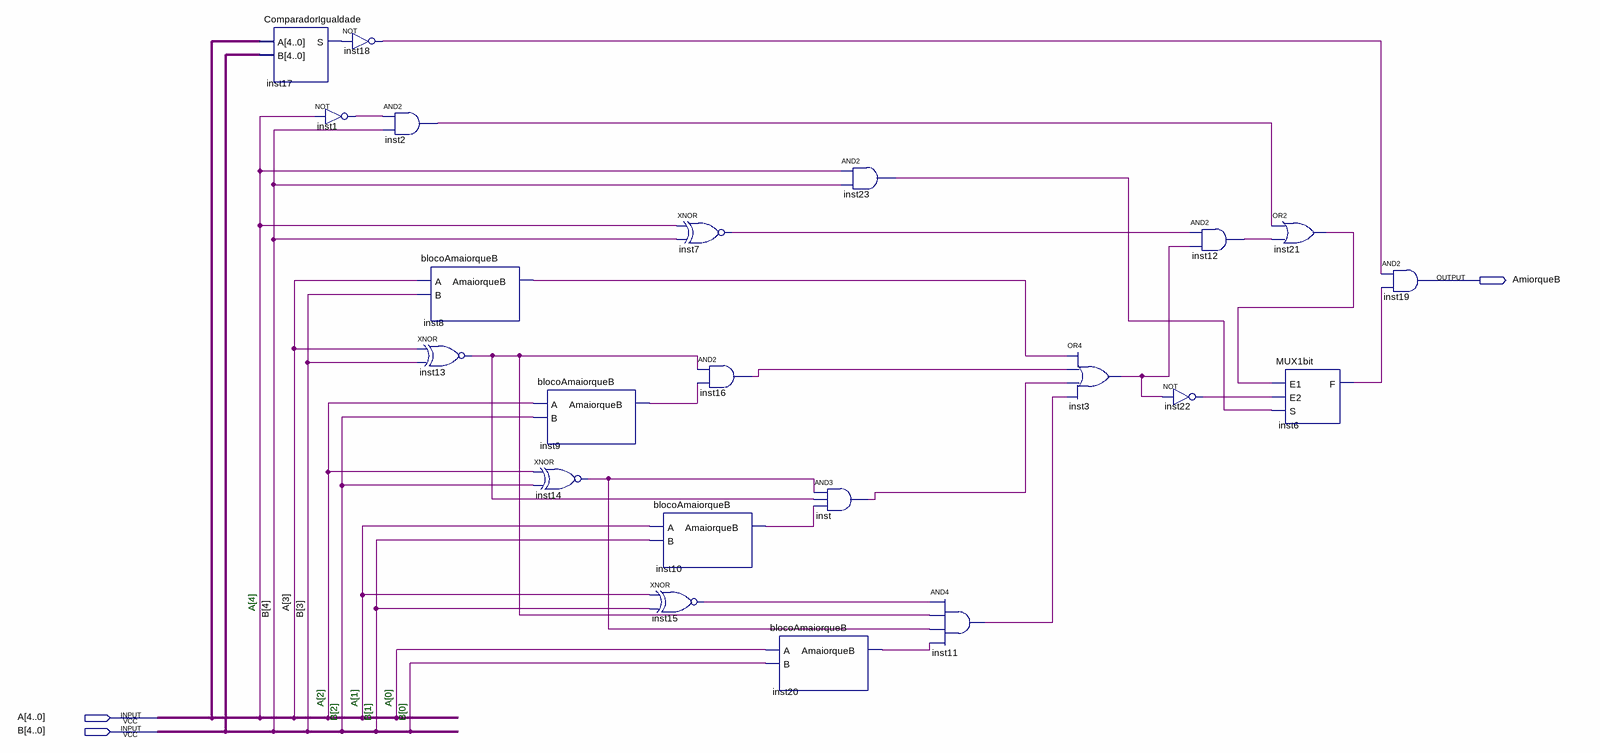
[diagram p0: schematic sheet]
// Quartus schematic ComparadorAmaiorqueB.bdf as structural Verilog: 22 symbols, 3 pins
module ComparadorAmaiorqueB (
  input  [4:0] A,
  input  [4:0] B,
  output AmiorqueB
);

  wire inst1_out, inst2_out, inst3_out, inst6_f, inst7_out, inst8_amaiorqueb, inst9_amaiorqueb,
       inst10_amaiorqueb, inst11_out, inst12_out, inst13_out, inst14_out, inst15_out, inst16_out, inst17_s,
       inst18_out, inst20_amaiorqueb, inst21_out, inst22_out, inst23_out, inst_out;

  ComparadorIgualdade inst17 (.A(A), .B(B), .S(inst17_s));
  not inst18 (inst18_out, inst17_s);
  not inst1 (inst1_out, A[4]);
  and inst2 (inst2_out, inst1_out, B[4]);
  blocoAmaiorqueB inst8 (.A(A[3]), .B(B[3]), .AmaiorqueB(inst8_amaiorqueb));
  xnor inst13 (inst13_out, A[3], B[3]);
  blocoAmaiorqueB inst9 (.A(A[2]), .B(B[2]), .AmaiorqueB(inst9_amaiorqueb));
  xnor inst14 (inst14_out, A[2], B[2]);
  xnor inst7 (inst7_out, A[4], B[4]);
  blocoAmaiorqueB inst10 (.A(A[1]), .B(B[1]), .AmaiorqueB(inst10_amaiorqueb));
  xnor inst15 (inst15_out, A[1], B[1]);
  and inst16 (inst16_out, inst13_out, inst9_amaiorqueb);
  blocoAmaiorqueB inst20 (.A(A[0]), .B(B[0]), .AmaiorqueB(inst20_amaiorqueb));
  and inst23 (inst23_out, A[4], B[4]);
  and inst (inst_out, inst14_out, inst13_out, inst10_amaiorqueb);
  and inst11 (inst11_out, inst15_out, inst13_out, inst14_out, inst20_amaiorqueb);
  or inst3 (inst3_out, inst8_amaiorqueb, inst16_out, inst_out, inst11_out);
  not inst22 (inst22_out, inst3_out);
  and inst12 (inst12_out, inst7_out, inst3_out);
  or inst21 (inst21_out, inst2_out, inst12_out);
  MUX1bit inst6 (.E1(inst21_out), .E2(inst22_out), .S(inst23_out), .F(inst6_f));
  and inst19 (AmiorqueB, inst18_out, inst6_f);

  // Notes on the sheet:
  //   A[4]
  //   A[2]
  //   A[1]
  //   A[0]
  //   B[2]
  //   B[1]
  //   B[0]
endmodule
